# Altium schematic sheet 2-MCU.SchDoc
size B
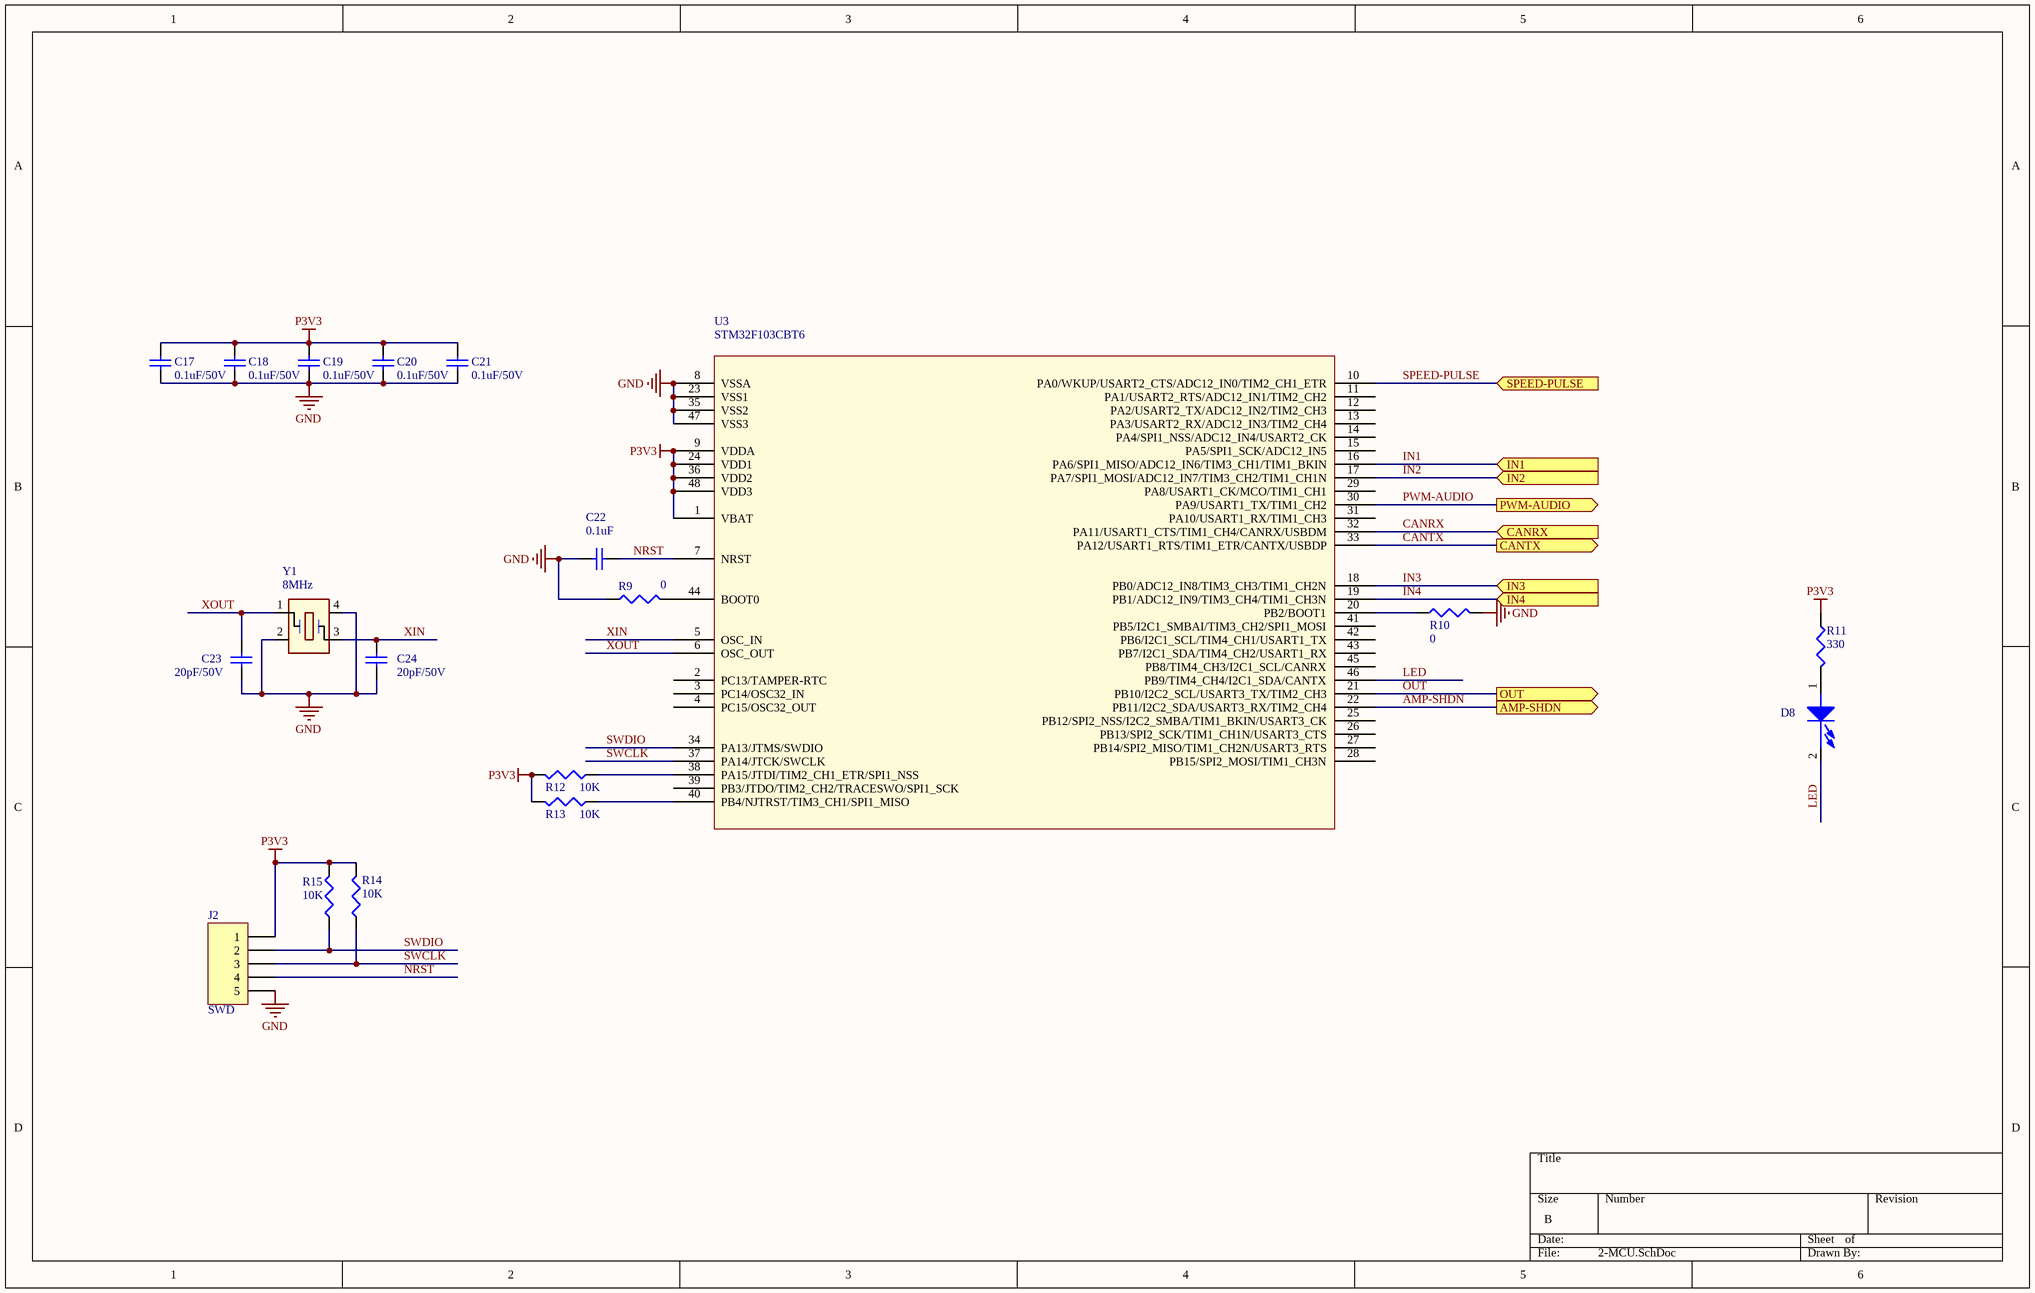
[diagram p0: 2-MCU.SchDoc]

## Parts
C17  0.1uF/50V  [0402]
C18  0.1uF/50V  [0402]
C19  0.1uF/50V  [0402]
C20  0.1uF/50V  [0402]
C21  0.1uF/50V  [0402]
C22  0.1uF  [0402]
C23  20pF/50V  [0402]
C24  20pF/50V  [0402]
D8  LED GREEN  [LED0603]  (value not drawn)
J2  SWD  [HDR1X5]
R9  0  [0402]
R10  0  [0402]
R11  330  [0402]
R12  10K  [0402]
R13  10K  [0402]
R14  10K  [0402]
R15  10K  [0402]
U3  STM32F103CBT6  [LQFP48]
Y1  8MHz  [XTAL4_SX_3225]

## Ports
AMP-SHDN (out), CANRX (in), CANTX (out), IN1 (in), IN2 (in), IN3 (in), IN4 (in), OUT (out), PWM-AUDIO (out), SPEED-PULSE (in)

## Nets
GND: C17.1 C18.1 C19.1 C20.1 C21.1 C22.1 C23.2 C24.2 J2.5 R9.1 R10.2 U3.8(VSSA) U3.23(VSS1) U3.35(VSS2) U3.47(VSS3) Y1.2 Y1.4
P3V3: C17.2 C18.2 C19.2 C20.2 C21.2 J2.1 R11.1 R12.2 R13.2 R14.2 R15.2 U3.1(VBAT) U3.9(VDDA) U3.24(VDD1) U3.36(VDD2) U3.48(VDD3)
AMP-SHDN: U3.22(PB11/I2C2_SDA/USART3_RX/TIM2_CH4) ; port AMP-SHDN
CANRX: U3.32(PA11/USART1_CTS/TIM1_CH4/CANRX/USBDM) ; port CANRX
CANTX: U3.33(PA12/USART1_RTS/TIM1_ETR/CANTX/USBDP) ; port CANTX
IN1: U3.16(PA6/SPI1_MISO/ADC12_IN6/TIM3_CH1/TIM1_BKIN) ; port IN1
IN2: U3.17(PA7/SPI1_MOSI/ADC12_IN7/TIM3_CH2/TIM1_CH1N) ; port IN2
IN3: U3.18(PB0/ADC12_IN8/TIM3_CH3/TIM1_CH2N) ; port IN3
IN4: U3.19(PB1/ADC12_IN9/TIM3_CH4/TIM1_CH3N) ; port IN4
LED: D8.2(CATHODE) U3.46(PB9/TIM4_CH4/I2C1_SDA/CANTX)
NRST: C22.2 J2.4 U3.7(NRST)
OUT: U3.21(PB10/I2C2_SCL/USART3_TX/TIM2_CH3) ; port OUT
PWM-AUDIO: U3.30(PA9/USART1_TX/TIM1_CH2) ; port PWM-AUDIO
SPEED-PULSE: U3.10(PA0/WKUP/USART2_CTS/ADC12_IN0/TIM2_CH1_ETR) ; port SPEED-PULSE
SWCLK: J2.3 R14.1 U3.37(PA14/JTCK/SWCLK)
SWDIO: J2.2 R15.1 U3.34(PA13/JTMS/SWDIO)
XIN: C24.1 U3.5(OSC_IN) Y1.3
XOUT: C23.1 U3.6(OSC_OUT) Y1.1
NetD8_1: D8.1(ANODE) R11.2
NetR9_2: R9.2 U3.44(BOOT0)
NetR10_1: R10.1 U3.20(PB2/BOOT1)
NetR12_1: R12.1 U3.38(PA15/JTDI/TIM2_CH1_ETR/SPI1_NSS)
NetR13_1: R13.1 U3.40(PB4/NJTRST/TIM3_CH1/SPI1_MISO)

Not connected (* = marked no-connect by the designer): U3 2(PC13/TAMPER-RTC) 3(PC14/OSC32_IN) 4(PC15/OSC32_OUT) 11(PA1/USART2_RTS/ADC12_IN1/TIM2_CH2) 12(PA2/USART2_TX/ADC12_IN2/TIM2_CH3) 13(PA3/USART2_RX/ADC12_IN3/TIM2_CH4) 14(PA4/SPI1_NSS/ADC12_IN4/USART2_CK) 15(PA5/SPI1_SCK/ADC12_IN5) 25(PB12/SPI2_NSS/I2C2_SMBA/TIM1_BKIN/USART3_CK) 26(PB13/SPI2_SCK/TIM1_CH1N/USART3_CTS) 27(PB14/SPI2_MISO/TIM1_CH2N/USART3_RTS) 28(PB15/SPI2_MOSI/TIM1_CH3N) 29(PA8/USART1_CK/MCO/TIM1_CH1) 31(PA10/USART1_RX/TIM1_CH3) 39(PB3/JTDO/TIM2_CH2/TRACESWO/SPI1_SCK) 41(PB5/I2C1_SMBAI/TIM3_CH2/SPI1_MOSI) 42(PB6/I2C1_SCL/TIM4_CH1/USART1_TX) 43(PB7/I2C1_SDA/TIM4_CH2/USART1_RX) 45(PB8/TIM4_CH3/I2C1_SCL/CANRX)

## Library data of the parts
C17-C21 = Cap: Capacitor; Value: 0.1uF; Published: 8-Jun-2000; LatestRevisionDate: 17-Jul-2002; LatestRevisionNote: Re-released for DXP Platform.; PackageReference: RAD-0.3; Publisher: Altium Limited; PackageDescription: Radial Cap, Thru-Hole; 2 Leads; 0.3 in Pin Spacing
C22-C24 = Cap: Capacitor; Published: 8-Jun-2000; LatestRevisionDate: 17-Jul-2002; LatestRevisionNote: Re-released for DXP Platform.; PackageReference: RAD-0.3; Publisher: Altium Limited; PackageDescription: Radial Cap, Thru-Hole; 2 Leads; 0.3 in Pin Spacing
  C22: Value: 0.1uF
D8 = LN01401_1
J2 = Header 5: Header, 5-Pin; LatestRevisionDate: 17-Jul-2002; LatestRevisionNote: Re-released for DXP Platform.; Publisher: Altium Limited
R9 R10 R12-R15 = Res3: Resistor; Value: 1K; Published: 8-Jun-2000; LatestRevisionDate: 29-May-2009; LatestRevisionNote: IPC-7351 Footprint Added.; PackageReference: J1-0603; Publisher: Altium Limited; PackageDescription: Chip Resistor
R11 = CR16-1003FM
U3 = STM32F103CX-LQFP48
Y1 = XTAL_13Y_A: XTAL 24MHZ -- 3.2X2.5MM SMT; CLASS: IC; CAD_APPROVED: Yes; MFG_PN01: XTL571300LLI24.000-10TR; MFG_NAME01: SIWARD INTERNATIONAL INC; AGILE_PN: 230-76455; HEIGHT: 0.8MM; ROHS: Yes